# Altium schematic sheet 2_PowerRails.SchDoc: Power Conversion + Rails
size B; Author: Praveen Perera; DrawnBy: Praveen Perera; Engineer: Praveen Perera; Revision: 0; SheetNumber: 2; SheetTotal: 9
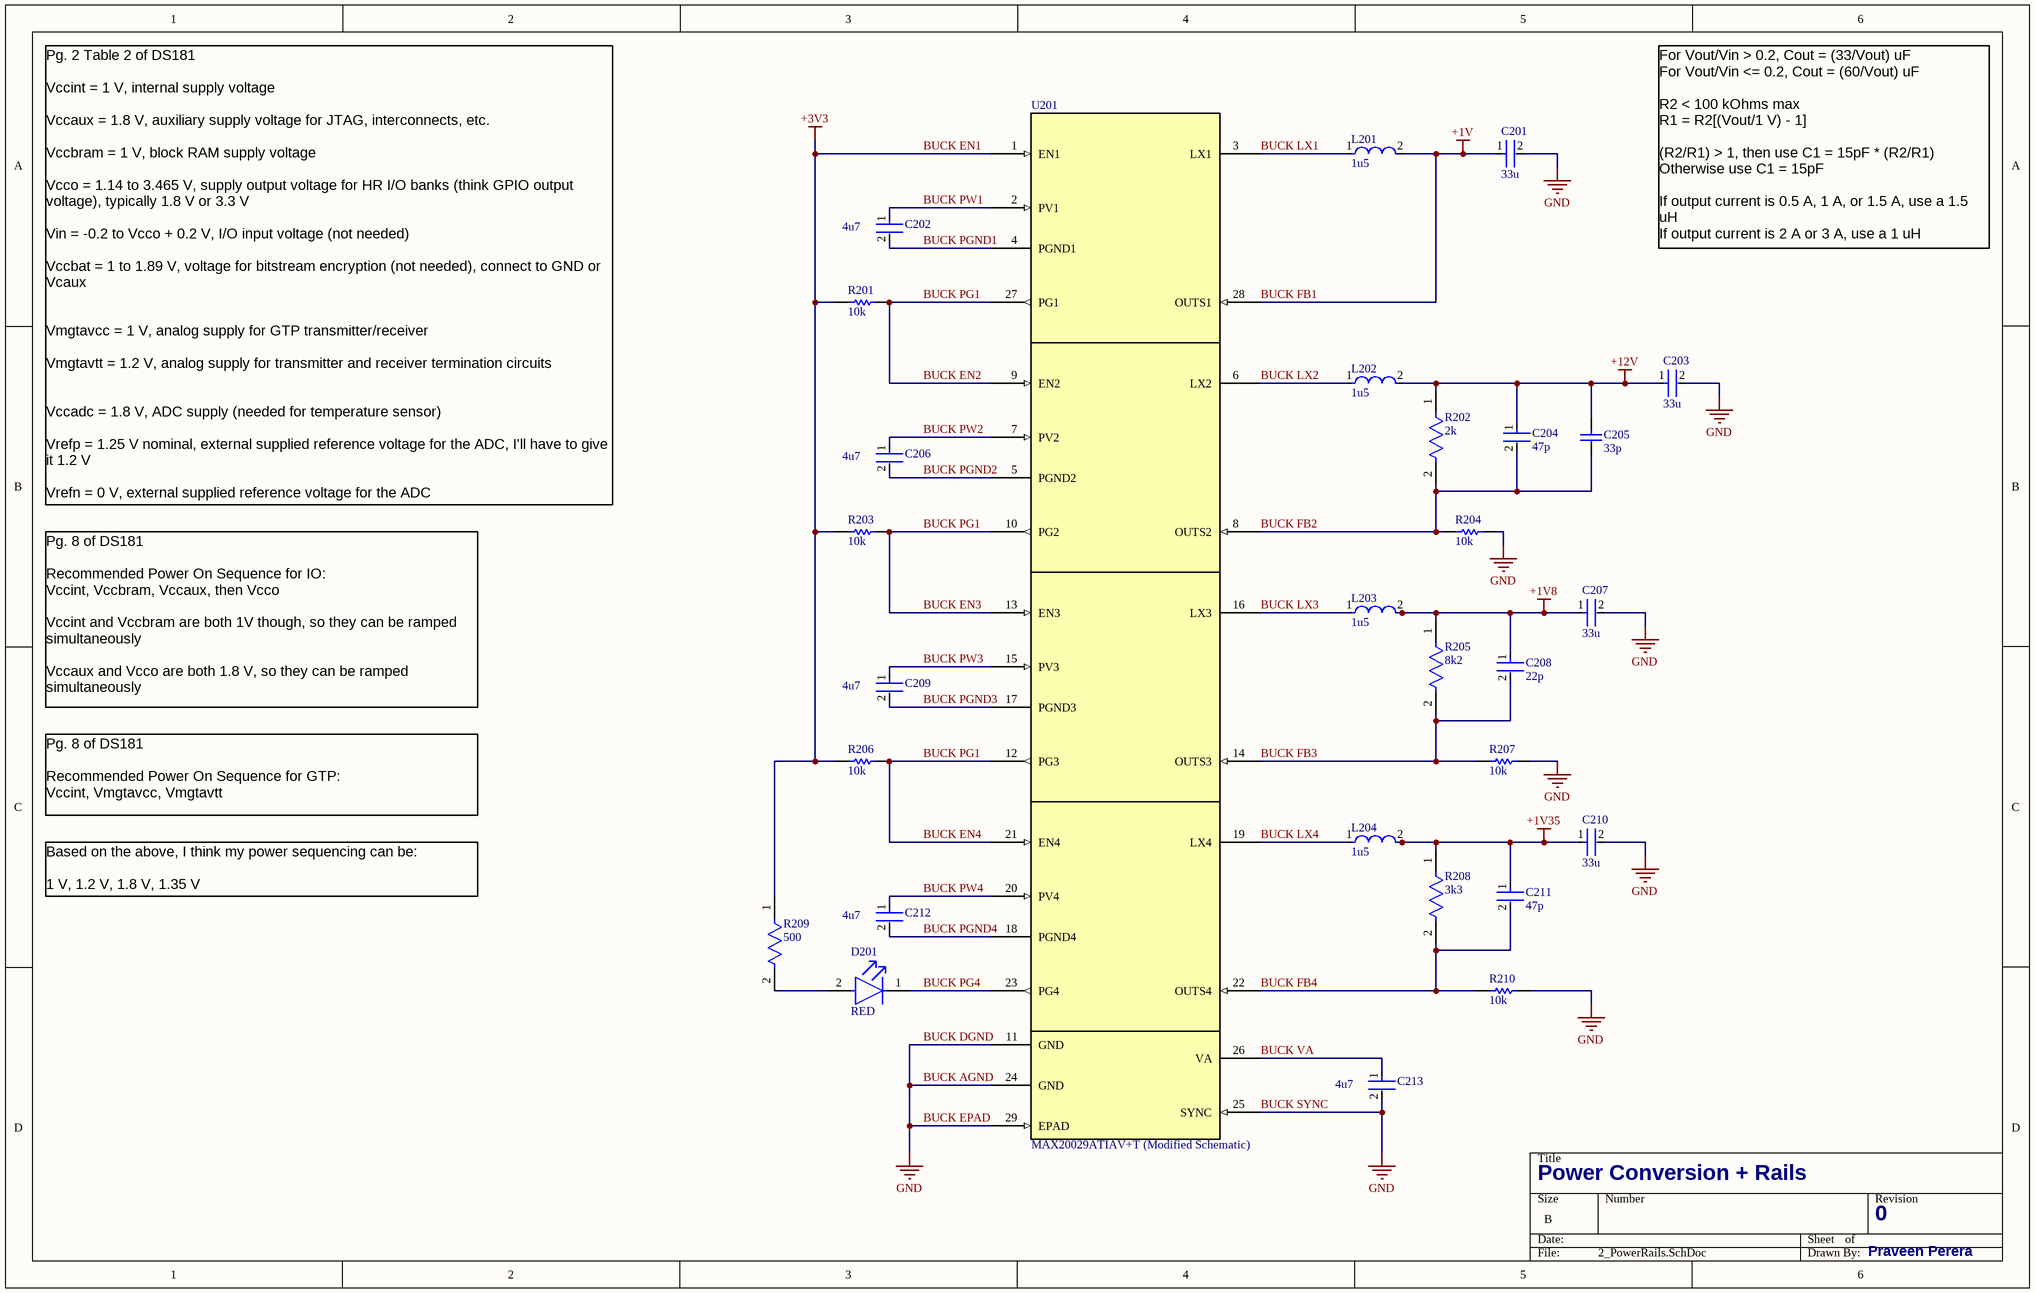
[diagram p0: 2_PowerRails.SchDoc]

## Parts
C201  33u  [FP-C2012-125-0_2-IPC_A]
C202  4u7  [FP-GCM31C-0_2-e0_3_0_8-IPC_C]
C203  33u  [FP-C2012-125-0_2-IPC_A]
C204  47p  [FP-GCQ155-0_05-MFG]
C205  33p  [CAPC1005X60X26NL10T16]
C206  4u7  [FP-GCM31C-0_2-e0_3_0_8-IPC_C]
C207  33u  [FP-C2012-125-0_2-IPC_A]
C208  22p  [FP-GJM155-0_05-IPC_A]
C209  4u7  [FP-GCM31C-0_2-e0_3_0_8-IPC_C]
C210  33u  [FP-C2012-125-0_2-IPC_A]
C211  47p  [FP-GCQ155-0_05-MFG]
C212  4u7  [FP-GCM31C-0_2-e0_3_0_8-IPC_C]
C213  4u7  [FP-GCM31C-0_2-e0_3_0_8-IPC_C]
D201  RED  [FP-SML-LX0603SIW-TR-MFG]
L201  1u5  [FP-IHLP-2525CZ-FP_2_413x3-MFG]
L202  1u5  [FP-IHLP-2525CZ-FP_2_413x3-MFG]
L203  1u5  [FP-IHLP-2525CZ-FP_2_413x3-MFG]
L204  1u5  [FP-IHLP-2525CZ-FP_2_413x3-MFG]
R201  10k  [RESC1005X40X25LL10T10]
R202  2k  [FP-MCS0402-IPC_A]
R203  10k  [RESC1005X40X25LL10T10]
R204  10k  [RESC1005X40X25LL10T10]
R205  8k2  [FP-ERA2A-MFG]
R206  10k  [RESC1005X40X25LL10T10]
R207  10k  [RESC1005X40X25LL10T10]
R208  3k3  [FP-ERA2A-MFG]
R209  500  [FP-PNM0402-MFG]
R210  10k  [RESC1005X40X25LL10T10]
U201  MAX20029ATIAV+T (Modified Schematic)  [21-0140L_T2855-5_MXM]

## Nets
+1V8: C207.1 C208.1 L203.2 R205.1
+1V35: C210.1 C211.1 L204.2 R208.1
+12V: C203.1 C204.1 C205.2 L202.2 R202.1
BUCK AGND: C201.2 C203.2 C207.2 C210.2 C213.2 R204.2 R207.2 R210.2 U201.11(GND) U201.24(GND) U201.25(SYNC) U201.29(EPAD)  [also labelled BUCK DGND, BUCK EPAD, BUCK SYNC, GND]
BUCK EN1: R201.1 R203.1 R206.1 R209.1 U201.1(EN1)  [also labelled +3V3]
BUCK FB1: C201.1 L201.2 U201.28(OUTS1)  [also labelled +1V]
BUCK EN2: R201.2 R203.2 R206.2 U201.9(EN2) U201.10(PG2) U201.12(PG3) U201.13(EN3) U201.21(EN4) U201.27(PG1)  [also labelled BUCK EN3, BUCK EN4, BUCK PG1]
BUCK FB2: C204.2 C205.1 R202.2 R204.1 U201.8(OUTS2)
BUCK FB3: C208.2 R205.2 R207.1 U201.14(OUTS3)
BUCK FB4: C211.2 R208.2 R210.1 U201.22(OUTS4)
BUCK LX1: L201.1 U201.3(LX1)
BUCK LX2: L202.1 U201.6(LX2)
BUCK LX3: L203.1 U201.16(LX3)
BUCK LX4: L204.1 U201.19(LX4)
BUCK PG4: D201.1(C) U201.23(PG4)
BUCK PGND1: C202.2 U201.4(PGND1)
BUCK PGND2: C206.2 U201.5(PGND2)
BUCK PGND3: C209.2 U201.17(PGND3)
BUCK PGND4: C212.2 U201.18(PGND4)
BUCK PW1: C202.1 U201.2(PV1)
BUCK PW2: C206.1 U201.7(PV2)
BUCK PW3: C209.1 U201.15(PV3)
BUCK PW4: C212.1 U201.20(PV4)
BUCK VA: C213.1 U201.26(VA)
NetD201_2: D201.2(A) R209.2

## Notes on the sheet
- For Vout/Vin > 0.2, Cout = (33/Vout) uF
  For Vout/Vin <= 0.2, Cout = (60/Vout) uF
  R2 < 100 kOhms max
  R1 = R2[(Vout/1 V) - 1]
  (R2/R1) > 1, then use C1 = 15pF * (R2/R1)
  Otherwise use C1 = 15pF
  If output current is 0.5 A, 1 A, or 1.5 A, use a 1.5 uH
  If output current is 2 A or 3 A, use a 1 uH
  If output voltage is less than 0.9 V, use a 0.47 uH
- Pg. 2 Table 2 of DS181
  Vccint = 1 V, internal supply voltage
  Vccaux = 1.8 V, auxiliary supply voltage for JTAG, interconnects, etc.
  Vccbram = 1 V, block RAM supply voltage
  Vcco = 1.14 to 3.465 V, supply output voltage for HR I/O banks (think GPIO output voltage), typically 1.8 V or 3.3 V
  Vin = -0.2 to Vcco + 0.2 V, I/O input voltage (not needed)
  Vccbat = 1 to 1.89 V, voltage for bitstream encryption (not needed), connect to GND or Vcaux
  Vmgtavcc = 1 V, analog supply for GTP transmitter/receiver
  Vmgtavtt = 1.2 V, analog supply for transmitter and receiver termination circuits
  Vccadc = 1.8 V, ADC supply (needed for temperature sensor)
  Vrefp = 1.25 V nominal, external supplied reference voltage for the ADC, I'll have to give it 1.2 V
  Vrefn = 0 V, external supplied reference voltage for the ADC
- Pg. 8 of DS181
  Recommended Power On Sequence for IO:
  Vccint, Vccbram, Vccaux, then Vcco
  Vccint and Vccbram are both 1V though, so they can be ramped simultaneously
  Vccaux and Vcco are both 1.8 V, so they can be ramped simultaneously
- Pg. 8 of DS181
  Recommended Power On Sequence for GTP:
  Vccint, Vmgtavcc, Vmgtavtt
- Based on the above, I think my power sequencing can be:
  1 V, 1.2 V, 1.8 V, 1.35 V

## Library data of the parts
C201 C203 C207 C210 = CMP-08246-002720-1: C2012X5R1A336M125AC / Multilayer Ceramic Capacitors 33μF ±20% 10V X5R SMD 0805; Capacitance: 33uF; Dielectric: X5R; Series: C; Packaging: Tape and Reel; Voltage Rating: 10V; Height: 1.25mm; Tolerance: 20%; Thickness: 0.057inch; Min Operating Temperature: -55°C; Max Operating Temperature: 85°C; Case Code (Imperial): 0805; Voltage Rating (DC): 10V; Case Code (Metric): 2012; Length: 2mm; REACH SVHC: No SVHC; Depth: 1.25mm; Package Quantity: 1; Dielectric Material: Ceramic; Lead Free: Lead Free; Case/Package: 0805; Termination: SMD/SMT; Resistor Type: Ceramic; RoHS Compliant: Yes; Width: 0.049inch; Weight: 0.000194oz; Mount: Surface Mount
C202 C206 C209 C212 C213 = CMP-06035-020722-1: GCM31CR71E475KA55K / Ceramic Capacitor for Automotive 4.7uF ±10% 25VDC X7R 1206 Embossed T/R; Voltage Rating: 25V; Case Code (Imperial): 1206; Depth: 1.6mm; Length: 3.2mm; Ratings: AEC-Q200; Capacitance: 4.7uF; Height: 1.6mm; Case/Package: 1206; Packaging: Tape and Reel; Radiation Hardening: No; Dielectric: X7R; Case Code (Metric): 3216; Termination: SMD/SMT; Package Quantity: 6000; Max Operating Temperature: 125°C; Voltage Rating (DC): 25V; Thickness: 0.071inch; Width: 0.063inch; Min Operating Temperature: -55°C; Mount: Surface Mount; Tolerance: 10%
C204 C211 = CMP-06035-040611-1: GCQ1555C1H470GB01D / High Q Ceramic Capacitor for Automotive 47pF ±2% 50VDC C0G 0402 Paper T/R
C205 = CMP-2008-01050-1: VJ0402A330JXAAC; Manufacturer: Vitramon; Part Number: VJ0402A330JXAAC
C208 = CMP-06035-061679-1: GJM1555C1H220GB01D / Multi-Layer Ceramic Capacitor 22pF C0G  ±2% 0402 Paper T/R; Voltage Rating (DC): 50V; Length: 1mm; Thickness: 500um; Tolerance: 2%; Capacitance: 22pF; RoHS Compliant: Yes; Dielectric: C0G; Width: 500um
D201 = CMP-57192-000009-1: SML-LX0603SIW-TR / LED RED DIFFUSED SMD; Test Current: 20mA; Forward Voltage: 2V; Approvals: UL; Dominant Wavelength: 636nm; Viewing Angle: 140°; Lens Color: White; Luminous Intensity: 60mcd; Power Rating: 50mW; Number of LEDs: 1; Color: Red; Forward Current: 20mA; Moisture Sensitivity Level: 2; Case Code (Imperial): 0603; Lead Free: Lead Free; Lens Transparency: Diffused; Case Code (Metric): 1608; Height: 0.6mm; Max Operating Temperature: 85°C; Width: 0.8mm; Lens Style: Diffused; Illumination Color: Red; Wavelength: 636nm; REACH SVHC: No SVHC; Package Quantity: 1; RoHS Compliant: Yes; Case/Package: 0603; Number of Pins: 2; Packaging: Tape and Reel; Length: 1.6mm; Mount: Surface Mount; Min Operating Temperature: -25°C
L201-L204 = CMP-02424-000713-1: IHLP2525CZER1R5M07 / Commercial Inductors, High Saturation Series, 5 % DCR Tolerance 1.5uH 9A 14.5mΩ 20%; DC Resistance (DCR): 14.5mR; Saturation Current: 18A; Test Frequency: 100kHz; Shielding: Shielded; Lead Free: Lead Free; Tolerance: 20%; Radiation Hardening: No; Series: IHLP-2525CZ-07; Width: 0.255inch; Length: 0.27inch; Depth: 6.72mm; Case/Package: Nonstandard; Height: 3mm; Mount: Surface Mount; Package Quantity: 2000; Current Rating: 9A; Height - Seated (Max): 0.118inch; Packaging: Tape and Reel; Inductance: 1.5uH; Max Operating Temperature: 125°C; Min Operating Temperature: -55°C
R201 R203 R204 R206 R207 R210 = CMP-2002-04584-1: SG73P1ETTP1002F; Manufacturer: KOA Speer; Part Number: SG73P1ETTP1002F
R202 = CMP-02407-003721-1: MCS0402MD2001BE100 / RES SMD 1.2K OHM 1% 1/10W 0402; Resistance: 2kR; Temperature Coefficient: 25ppm/°C; Power Rating: 63mW; Voltage Rating: 50V; Tolerance: 0.1%; Lead Free: Lead Free; Max Operating Temperature: 155°C; Case/Package: 0402; Case Code (Metric): 1005; Height: 0.32mm; Composition: Thin Film; Weight: 2.1E-05oz; Width: 0.5mm; Case Code (Imperial): 0402; Packaging: Tape and Reel; Length: 1mm; Min Operating Temperature: -55°C; Contact Plating: Tin
R205 = CMP-2002-05828-2: ERA-2AEB822X / RES SMD 8.2K OHM 0.1% 1/16W 0402; Manufacturer: Panasonic Electronic Components; Value: 8.2kΩ; Temperature Coefficient: 25ppm/°C; Voltage Rating: 50V; Automotive Grade: Grade 0; Power Rating: 0.063W; Temperature Range Low: -55°C; Lead Free: Yes; Device Class L2: Resistors; Height: 0.4mm; RoHS: TRUE; Mouser Description: Thin Film Resistors - SMD 0402 1/16W 8.2Kohms; Octopart: https://octopart.com/era-2aeb822x-panasonic-43284358; Tolerance: 0.1%; Composition: Thin Film; Package: ERA2A; Resistance: 8.2kΩ; Temperature: -55°C to +155°C; Series: ERA; Manufacturer Part Number: ERA-2AEB822X; ComponentLink2URL: https://industrial.panasonic.com/cdbs/www-data/pdf/RDM0000/AOA0000C307.pdf; Digikey Description: RES SMD 8.2K OHM 0.1% 1/16W 0402; ComponentLink2Description: Datasheet; Category: Res; Footprint Url: https://industrial.panasonic.com/cdbs/www-data/pdf/RDM0000/DMM0000COL17.pdf; Temperature Range High: +155°C; Automotive: Yes; Device Class L1: Passive Components; Device Class L3: Chip SMD Resistors
R208 = CMP-2002-05884-2: ERA-2AEB332X; NexarPartId: 9251384; Voltage Rating (DC): 25V; Temperature Coefficient: 25ppm/°C; Tolerance: 0.1%; Resistance: 3.3kΩ; Power Rating: 63mW; Case/Package: 0402; Number of Terminations: 2; Military Standard: Not; Case Code (Imperial): 0402; Length: 1mm; Contact Plating: Tin; Termination: SMD/SMT; Schedule B: 8533210045, 8533210045; Voltage Rating: 25V; Lead Free: Lead Free; Min Operating Temperature: -55°C; REACH SVHC: No SVHC; Max Power Dissipation: 63mW; Weight: 793.786648µg; RoHS: Compliant; Depth: 500µm; Packaging: Cut Tape; Max Operating Temperature: 155°C; Width: 500µm; Case Code (Metric): 1005; Height: 350µm; Composition: Thin Film; Lifecycle Status: Production; Radiation Hardening: No; Number of Pins: 2; Mount: Surface Mount
R209 = CMP-02407-011888-1: PNM0402E5000BST1 / RES SMD 500 OHM 0.1% 1/20W 0402; Temperature Coefficient: 25ppm/°C; Max Power Dissipation: 50mW; Resistance: 500R; Width: 0.022inch; Length: 0.042inch; Tolerance: 0.1%; Lead Free: Lead Free; Height: 0.033inch; Case Code (Metric): 1005; Features: Moisture Resistant; Case Code (Imperial): 0402; Max Operating Temperature: 155°C; Case/Package: 0402; Min Operating Temperature: -55°C; Package Quantity: 1000; RoHS Compliant: Yes; Packaging: Tape and Reel; Resistor Type: Thin Film; Number of Terminations: 2
U201 = CMP-010-000006-2: Automotive Quad/Triple Low-Voltage Step-Down DC-DC Converters; Manufacturer_Name: Analog Devices / Maxim Integrated; Manufacturer_Part_Number: MAX20029ATIA/V+T; Source: MAX20029ATIAV&plus_T - Modified.SchLib; RefDes: RefDes; Design Item ID: MAX20029ATIAV+T; Copyright: Copyright (C) 2025 Ultra Librarian. All rights reserved.; Pin Count: 29; Component Type: Standard; Type: Type